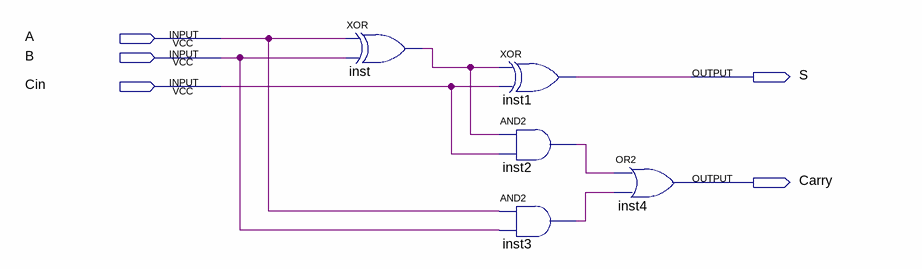
[diagram p0: schematic sheet]
// Quartus schematic Full_Adder.bdf as structural Verilog: 5 symbols, 5 pins
module Full_Adder (
  input  A,
  input  B,
  input  Cin,
  output S,
  output Carry
);

  wire inst2_out, inst3_out, inst_out;

  xor inst (inst_out, A, B);
  xor inst1 (S, inst_out, Cin);
  and inst2 (inst2_out, inst_out, Cin);
  and inst3 (inst3_out, A, B);
  or inst4 (Carry, inst2_out, inst3_out);
endmodule
